# EAGLE design EXP430FR2433_devBoard (EAGLE 9.3.2)
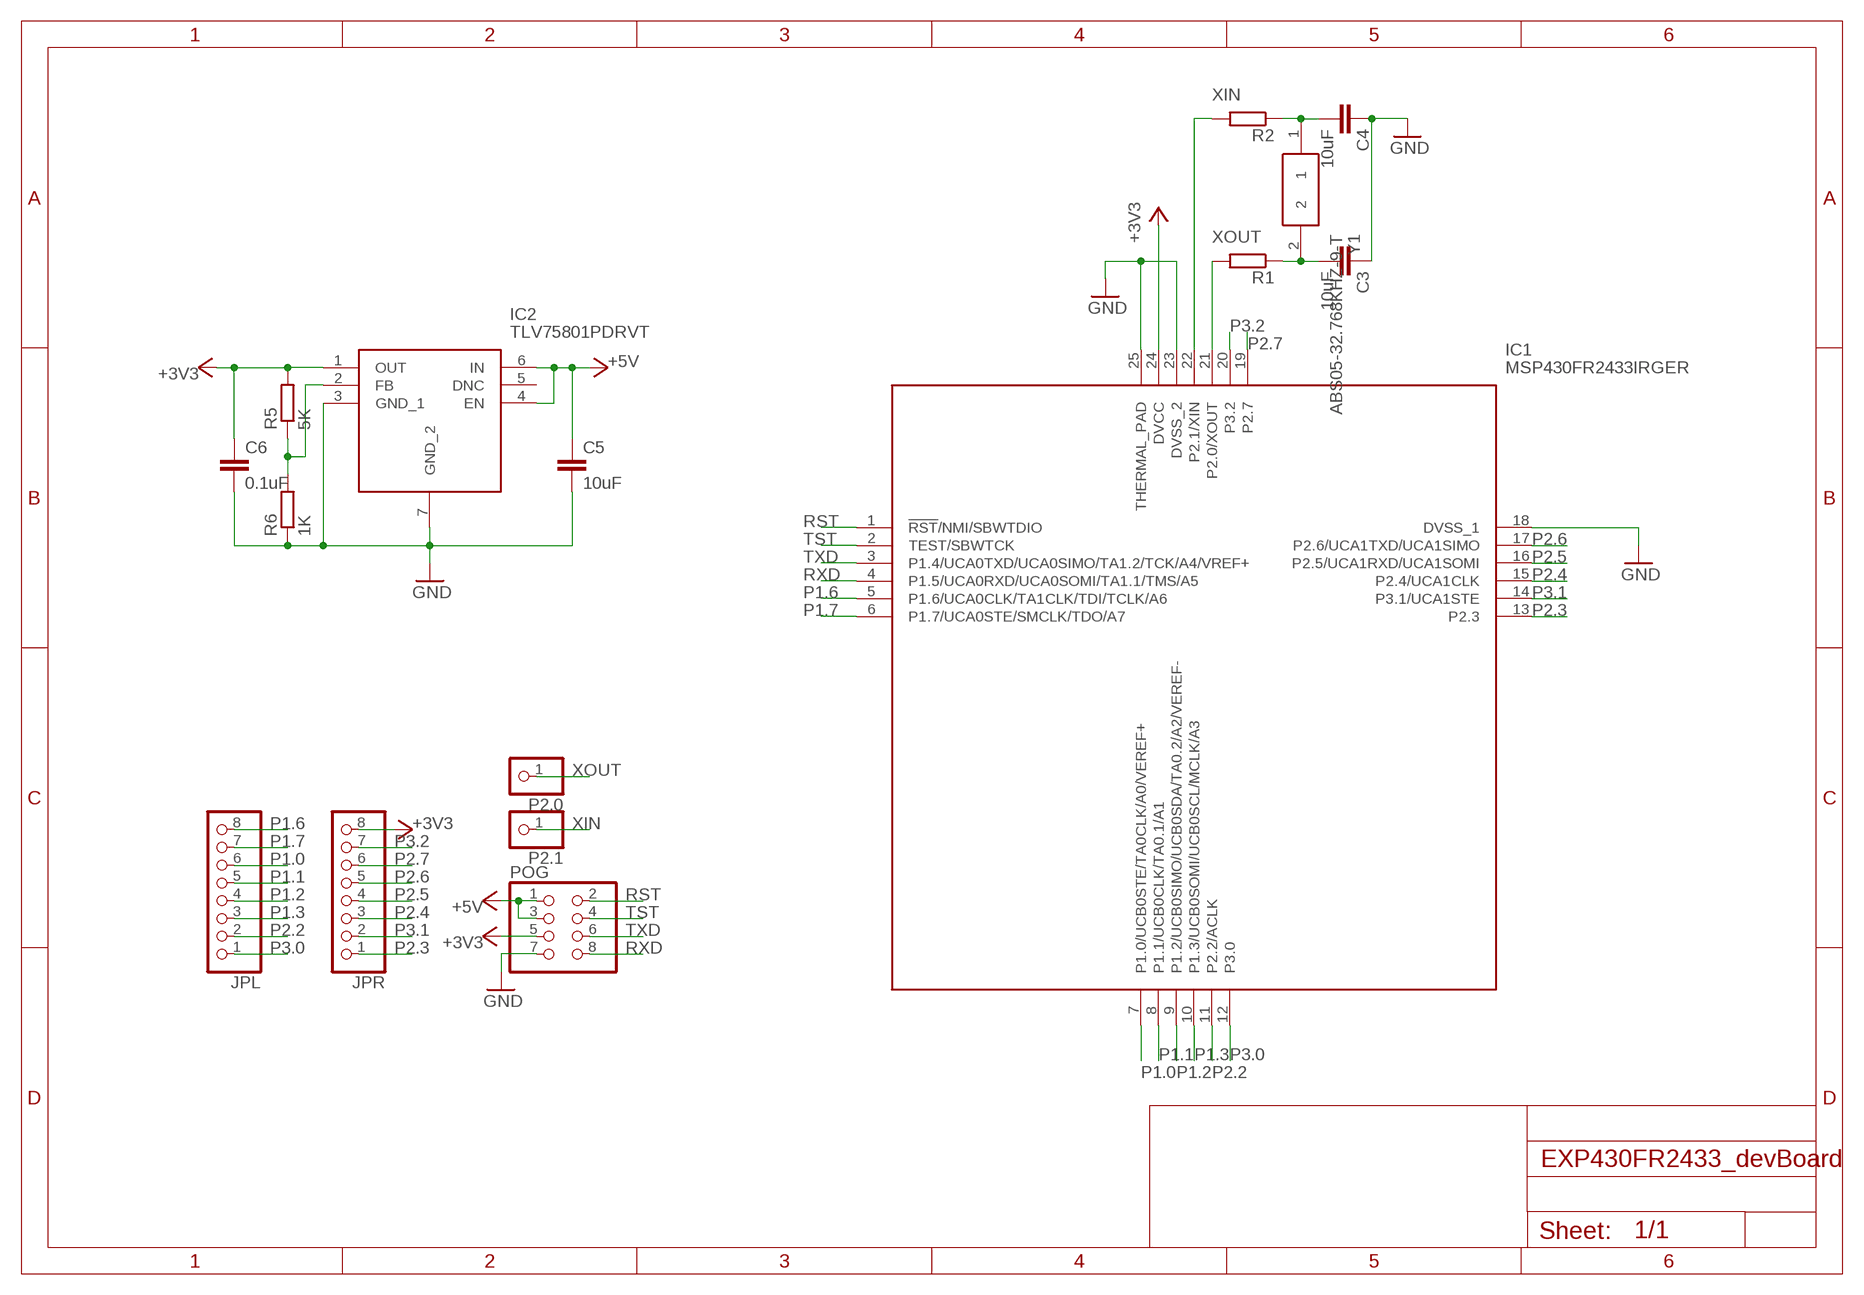
[diagram p0: schematic, sheet 1]

## Parts
C3  10uF  C-EUC0805K  [C0805K]
C4  10uF  C-EUC0805K  [C0805K]
C5  10uF  C-EUC0805K  [C0805K]
C6  0.1uF  C-EUC0805K  [C0805K]
IC1  MSP430FR2433IRGER  [QFN50P400X400X100-25N]
IC2  TLV75801PDRVT  [SON65P200X200X80-7N]
JPL  PINHD-1X8  [1X08]
JPR  PINHD-1X8  [1X08]
P2.0  PINHD-1X1  [1X01]
P2.1  PINHD-1X1  [1X01]
POG  PINHD-2X4  [2X04]
R1  R-EU_R0402  [R0402]
R2  R-EU_R0402  [R0402]
R5  5K  R-EU_R0805  [R0805]
R6  1K  R-EU_R0805  [R0805]
Y1  ABS05-32.768KHZ-9-T  [ABS05]

## Nets
+3V3: C6.1 IC1.24(DVCC) IC2.1(OUT) JPR.8 POG.5 R5.2
+5V: C5.1 IC2.4(EN) IC2.6(IN) POG.1 POG.3
GND: C3.1 C4.1 C5.2 C6.2 IC1.18(DVSS_1) IC1.23(DVSS_2) IC1.25(THERMAL_PAD) IC2.3(GND_1) IC2.7(GND_2) POG.7 R6.1
N$1: C3.2 R1.1 Y1.2
N$2: C4.2 R2.1 Y1.1
N$12: IC2.2(FB) R5.1 R6.2
P1.0: IC1.7(P1.0/UCB0STE/TA0CLK/A0/VEREF+) JPL.6
P1.1: IC1.8(P1.1/UCB0CLK/TA0.1/A1) JPL.5
P1.2: IC1.9(P1.2/UCB0SIMO/UCB0SDA/TA0.2/A2/VEREF-) JPL.4
P1.3: IC1.10(P1.3/UCB0SOMI/UCB0SCL/MCLK/A3) JPL.3
P1.6: IC1.5(P1.6/UCA0CLK/TA1CLK/TDI/TCLK/A6) JPL.8
P1.7: IC1.6(P1.7/UCA0STE/SMCLK/TDO/A7) JPL.7
P2.2: IC1.11(P2.2/ACLK) JPL.2
P2.3: IC1.13(P2.3) JPR.1
P2.4: IC1.15(P2.4/UCA1CLK) JPR.3
P2.5: IC1.16(P2.5/UCA1RXD/UCA1SOMI) JPR.4
P2.6: IC1.17(P2.6/UCA1TXD/UCA1SIMO) JPR.5
P2.7: IC1.19(P2.7) JPR.6
P3.0: IC1.12(P3.0) JPL.1
P3.1: IC1.14(P3.1/UCA1STE) JPR.2
P3.2: IC1.20(P3.2) JPR.7
RST: IC1.1(!RST!/NMI/SBWTDIO) POG.2
RXD: IC1.4(P1.5/UCA0RXD/UCA0SOMI/TA1.1/TMS/A5) POG.8
TST: IC1.2(TEST/SBWTCK) POG.4
TXD: IC1.3(P1.4/UCA0TXD/UCA0SIMO/TA1.2/TCK/A4/VREF+) POG.6
XIN: IC1.22(P2.1/XIN) P2.1.1 R2.2
XOUT: IC1.21(P2.0/XOUT) P2.0.1 R1.2
Unconnected: IC2.5(DNC)

## Library data of the parts
C3-C6 = rcl:C-EU: CAPACITOR, European symbol; SPICEPREFIX: C
IC1 = MSP430FR2433IRGER:MSP430FR2433IRGER: 16 MHz Ultra-Low-Power Microcontroller with 16 KB FRAM, 4 KB RAM, 10-bit ADC, 19 IO, 4 16-bit Timers Source: Datasheet <http://www.ti.com/lit/ds/symlink/msp430fr2433.pdf>; DESCRIPTION: 16 MHz Ultra-Low-Power Microcontroller with 16 KB FRAM, 4 KB RAM, 10-bit ADC, 19 IO, 4 16-bit Timers; HEIGHT: 1mm; MANUFACTURER_NAME: Texas Instruments; MANUFACTURER_PART_NUMBER: MSP430FR2433IRGER; MOUSER_PART_NUMBER: 595-SP430FR2433IRGER; MOUSER_PRICE-STOCK: https://www.mouser.com/Search/Refine.aspx?Keyword=595-SP430FR2433IRGER
IC2 = TLV75801PDRVT:TLV75801PDRVT: LDO Voltage Regulators 500MA LDO WITHOUT PG Source: Datasheet <http://www.ti.com/lit/ds/symlink/tlv758p.pdf>; DESCRIPTION: LDO Voltage Regulators 500MA LDO WITHOUT PG; HEIGHT: 0.8mm; MANUFACTURER_NAME: Texas Instruments; MANUFACTURER_PART_NUMBER: TLV75801PDRVT; MOUSER_PART_NUMBER: 595-TLV75801PDRVT; MOUSER_PRICE-STOCK: https://www.mouser.com/Search/Refine.aspx?Keyword=595-TLV75801PDRVT
JPL JPR = pinhead:PINHD-1X8: PIN HEADER
P2.0 P2.1 = pinhead:PINHD-1X1: PIN HEADER
POG = pinhead:PINHD-2X4: PIN HEADER
R1 R2 R5 R6 = rcl:R-EU_: RESISTOR, European symbol; SPICEPREFIX: R
Y1 = ABS05-32.768KHZ-9-T:ABS05-32.768KHZ-9-T: Crystals 32.768KHz 9.0pF 20ppm -40C +85C Source: Datasheet <http://www.abracon.com/Resonators/ABS05.pdf>; DESCRIPTION: Crystals 32.768KHz 9.0pF 20ppm -40C +85C; HEIGHT: mm; MANUFACTURER_NAME: ABRACON; MANUFACTURER_PART_NUMBER: ABS05-32.768KHZ-9-T; MOUSER_PART_NUMBER: 815-ABS05-32.768K9T; MOUSER_PRICE-STOCK: https://www.mouser.com/Search/Refine.aspx?Keyword=815-ABS05-32.768K9T; RS_PART_NUMBER: 815-ABS05-32.768K9T; RS_PRICE-STOCK: https://www.mouser.com/Search/Refine.aspx?Keyword=815-ABS05-32.768K9T

## Board
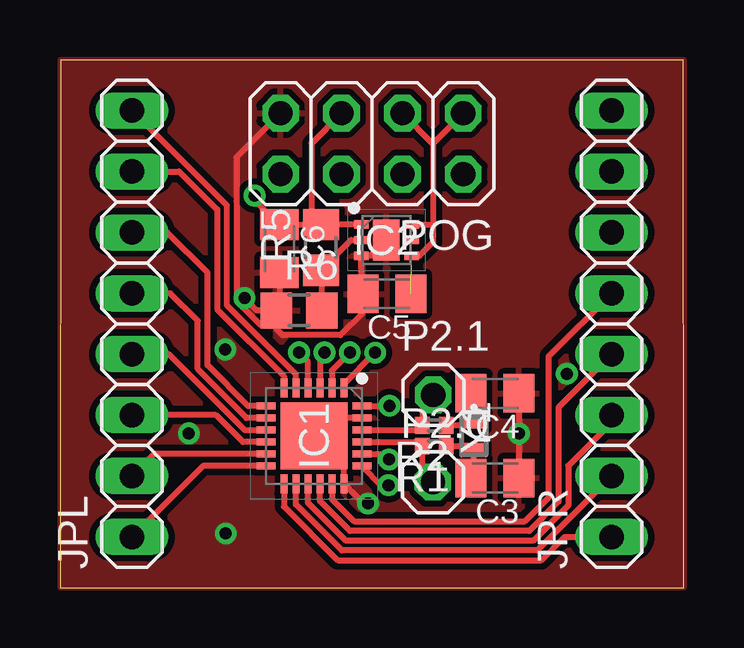
[diagram p1: board, top side]
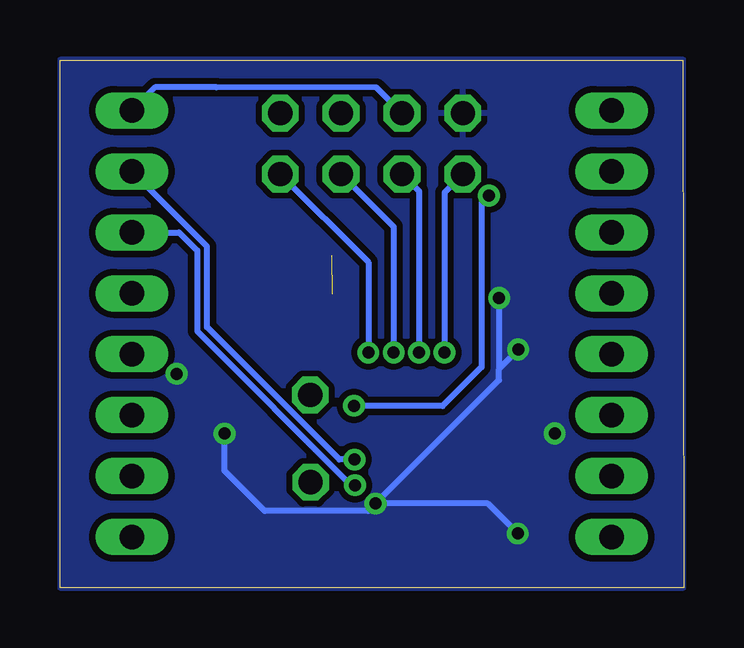
[diagram p2: board, bottom side, seen from below]

Size 26 x 22 mm. Coordinates in mm from the lower left corner, seen from the top.
Outline: 0,0 26,0 25.98,22 0.04,21.99 0,0
Copper layers (1*16): Top 0.035mm / dielectric 1.5mm / Bottom 0.035mm
Design rules "default *": minimum track width 6mil, minimum drill 0.35mm, track to track 6mil, track to pad 6mil, pad to pad 6mil, via to via 6mil, smd to smd 6mil, copper to edge 0mil, drill to drill 6mil, minimum pad ring 10mil, minimum via ring 8mil, stop-mask expansion 4mil, vias tented up to drill 0mil, thermal gap 10mil

### Footprints (pad centres in the part's own frame; a part is rotated, then mirrored left to right if it is on the bottom)
C0805K = smd 1.3 x 1.6: 1 -1,0; 2 1,0
QFN50P400X400X100-25N = smd 0.8 x 0.3: 1 -2,1.25; 2 -2,0.75; 3 -2,0.25; 4 -2,-0.25; 5 -2,-0.75; 6 -2,-1.25; 13 2,-1.25; 14 2,-0.75; 15 2,-0.25; 16 2,0.25; 17 2,0.75; 18 2,1.25 | smd 0.3 x 0.8: 7 -1.25,-2; 8 -0.75,-2; 9 -0.25,-2; 10 0.25,-2; 11 0.75,-2; 12 1.25,-2; 19 1.25,2; 20 0.75,2; 21 0.25,2; 22 -0.25,2; 23 -0.75,2; 24 -1.25,2 | smd 2.8 x 2.8: 25 0,0
SON65P200X200X80-7N = smd 0.6 x 0.35: 1 -1.05,0.65; 2 -1.05,0; 3 -1.05,-0.65; 4 1.05,-0.65; 5 1.05,0; 6 1.05,0.65 | smd 1.1 x 1.7: 7 0,0
1X08 = drill 1.016 long: 1 -8.89,0; 2 -6.35,0; 3 -3.81,0; 4 -1.27,0; 5 1.27,0; 6 3.81,0; 7 6.35,0; 8 8.89,0
1X01 = drill 1.016 octagon: 1 0,0
2X04 = drill 1.016 octagon: 1 -3.81,-1.27; 2 -3.81,1.27; 3 -1.27,-1.27; 4 -1.27,1.27; 5 1.27,-1.27; 6 1.27,1.27; 7 3.81,-1.27; 8 3.81,1.27
R0402 = smd 0.6 x 0.7: 1 -0.5,0; 2 0.5,0
R0805 = smd 1.3 x 1.5: 1 -0.95,0; 2 0.95,0
ABS05 = smd 0.5 x 1: 1 -0.55,0; 2 0.55,0

### Placement (x,y rotation side)
C3  18.14,4.57 180 top
C4  18.14,8.1 180 top
C5  13.63,12.25 180 top
C6  9.15,14.13 270 top
IC1  10.59,6.32 270 top
IC2  13.61,14.49 0 top
JPL  3,11 90 top
JPR  23,11 90 top
P2.0  15.55,4.39 0 top
P2.1  15.57,8.03 0 top
POG  13.01,18.51 180 top
R1  15.61,5.9 180 top
R2  15.61,6.76 180 top
R5  10.88,14.18 90 top
R6  9.97,11.56 0 top
U$1  [METRIC_15]  0,0 90 top
U$2  [METRIC_15]  0,0 180 bottom
U$3  [METRIC_15]  14.8,8.13 270 bottom
U$4  [METRIC_15]  1.99,0 90 bottom
U$5  [METRIC_15]  9.97,10.25 180 bottom
U$6  [METRIC_15]  26,0 90 bottom
U$7  [METRIC_15]  13,0 90 bottom
Y1  17.26,6.33 270 top

### Tracks (layer width: path | path; a pad name or v marks a point on that pad's centre or on a via)
+3V3  (via drill 0.5)
  Top 0.254: 10.48,15.13 C6.1 8.12,16.16 v8.12,16.34 | 10.48,15.13 R5.2 IC2.1 | POG.5 10.48,18.52 10.48,15.13 | IC1.24 v13.73,7.57 v13.74,7.58
  Bottom 0.254: POG.5 12.81,20.85 19.47,20.85 22.04,20.85 JPR.8 | v13.74,7.58 v13.73,7.57 10.05,7.57 8.43,9.2 8.43,16.03 v8.12,16.34
+5V  (1 unrouted)
  Top 0.254: 15.56,18.5 POG.3 | POG.1 15.56,18.52 15.56,18.5 | 15.56,18.5 15.56,15.18 | 15.56,15.18 15.56,14.41 14.99,13.84 IC2.4 | IC2.6 15.52,15.14 15.56,15.18
GND  (via drill 0.5)
  Top 0.254: IC2.7 12.96,13.84 IC2.3 12.56,12.32 C5.2 12.63,11.47 11.69,10.53 9.29,10.53 9.02,10.8 9.02,10.94 | C6.2 9.15,12.83 | 9.15,12.83 9.15,11.69 R6.1 | 9.02,10.94 R6.1 | C4.1 v19.14,6.42 C3.1 | IC1.23 11,7.07 10.85,6.92 10.85,6.58 IC1.25 11.84,5.07 IC1.18 12.66,3.5 v12.84,3.5 | 8.68,12.83 9.15,12.83 | POG.7 7.36,17.94 7.36,16.11 7.37,16.1 7.37,11.94 8.37,10.94 9.02,10.94 | R6.1 8.21,11.56 v7.69,12.07
  Bottom 0.254: v12.84,3.5 13.15,3.19 17.46,3.19 19.14,4.87 v19.14,6.42 | v7.69,12.07 7.69,9.12 | v12.84,3.5 7.69,8.65 7.69,9.12 | 7.69,9.12 v6.89,9.92 | v6.91,2.25 8.16,3.5 v12.84,3.5
  other vias: 5.37,6.42 21.13,8.91
  pour Top (isolate 0.254): 0.04,22.01 26,22.01 26,0 0.03,0 0.03,22.01
  pour Bottom (isolate 0.254): 0.02,22.01 26,22.01 26,0 0.01,0 0.01,22.01
N$1
  Top 0.254: R1.1 17.14,5.9 Y1.2 17.26,4.69 C3.2
N$2
  Top 0.254: R2.1 17.14,6.76 Y1.1 17.26,7.98 C4.2
N$12
  Top 0.254: R5.1 10.92,13.27 | IC2.2 12.14,14.49 11.04,13.39 10.92,13.27 | R6.2 10.92,13.27
P1.0
  Top 0.254: JPL.6 4.48,14.81 6.15,13.14 6.15,9.27 7.85,7.57 IC1.7
P1.1
  Top 0.254: IC1.8 7.78,7.07 5.74,9.1 5.74,11.13 4.6,12.27 JPL.5
P1.2
  Top 0.254: JPL.4 4.54,9.73 7.7,6.57 IC1.9
P1.3
  Top 0.254: JPL.3 6.51,7.19 7.63,6.07 IC1.10
P1.6
  Top 0.254: IC1.5 9.84,8.89 6.96,11.77 6.96,15.93 JPL.8
P1.7
  Top 0.254: JPL.7 4.96,17.35 6.55,15.76 6.55,11.6 9.34,8.81 IC1.6
P2.2
  Top 0.254: IC1.11 3.92,5.57 JPL.2
P2.3
  Top 0.254: IC1.13 9.34,3.38 11.58,1.14 20.07,1.14 21.04,2.11 JPR.1
P2.4
  Top 0.254: JPR.3 23,6.88 21.2,5.08 21.2,3.42 19.73,1.96 11.92,1.96 10.34,3.53 IC1.15
P2.5
  Top 0.254: JPR.4 20.79,7.52 20.79,3.59 19.56,2.36 12.09,2.36 10.84,3.61 IC1.16
P2.6
  Top 0.254: IC1.17 11.34,3.68 12.26,2.77 19.39,2.77 20.38,3.76 20.38,9.65 JPR.5
P2.7  (via drill 0.5)
  Top 0.254: IC1.19 13.39,4.27 v13.7,4.27
  Bottom 0.254: JPR.6 21.04,14.81 20.28,14.05 20.28,10.69 13.86,4.27 v13.7,4.27
P3.0
  Top 0.254: IC1.12 5.96,5.07 JPL.1
P3.1
  Top 0.254: JPR.2 19.9,1.55 11.75,1.55 9.84,3.46 IC1.14
P3.2  (via drill 0.5)
  Top 0.254: IC1.20 13.49,5.57 v13.72,5.34
  Bottom 0.254: v13.72,5.34 14.35,5.34 19.87,10.86 19.87,14.22 JPR.7
RST  (via drill 0.5)
  Top 0.254: v13.14,9.8 11.84,8.49 IC1.1
  Bottom 0.254: POG.2 13.14,13.56 v13.14,9.8
RXD  (via drill 0.5)
  Top 0.254: IC1.4 10.34,9.43 v9.97,9.8
  Bottom 0.254: POG.8 9.97,16.47 v9.97,9.8
TST  (via drill 0.5)
  Top 0.254: v12.09,9.8 11.34,9.05 IC1.2
  Bottom 0.254: POG.4 12.09,15.05 v12.09,9.8
TXD  (via drill 0.5)
  Top 0.254: v11.03,9.8 10.84,9.61 IC1.3
  Bottom 0.254: POG.6 11.03,16.53 v11.03,9.8
XIN
  Top 0.254: P2.1.1 15.11,7.57 R2.2 14.92,6.57 IC1.22
XOUT
  Top 0.254: P2.0.1 15.11,4.83 R1.2 14.94,6.07 IC1.21